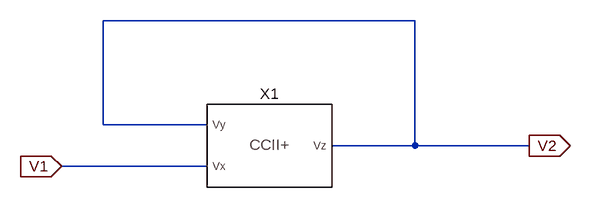
[diagram p0: schematic I-NIC.asc]
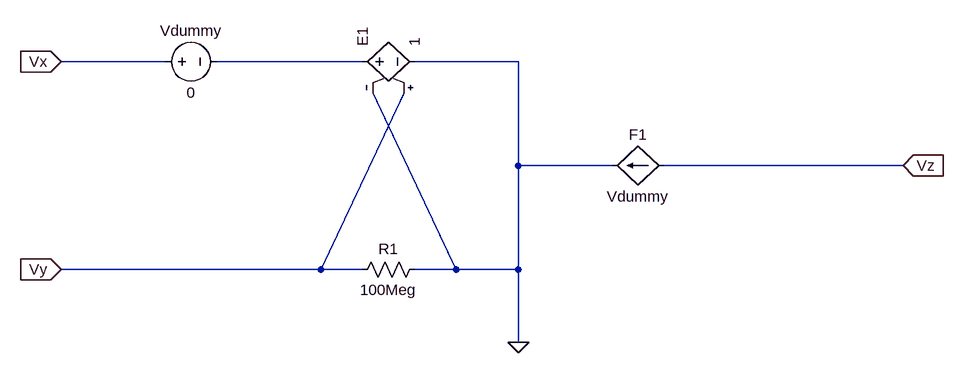
[diagram p1: sub-circuit ccii+.asc]
I-NIC.asc, the LTspice schematic file:
Version 4
SHEET 1 880 680
WIRE 464 0 -16 0
WIRE -16 160 -16 0
WIRE 144 160 -16 160
WIRE 464 192 464 0
WIRE 464 192 336 192
WIRE 640 192 464 192
WIRE 144 224 -80 224
FLAG -80 224 V1
IOPIN -80 224 In
FLAG 640 192 V2
IOPIN 640 192 Out
SYMBOL CCII+ 240 192 R0
SYMATTR InstName X1

ccii+.asc, the sub-circuit schematic file:
Version 4
SHEET 1 1476 680
WIRE -80 64 -240 64
WIRE 224 64 0 64
WIRE 464 64 304 64
WIRE 464 224 464 64
WIRE 608 224 464 224
WIRE 1056 224 688 224
WIRE 160 384 288 112
WIRE 160 384 -240 384
WIRE 224 384 160 384
WIRE 368 384 240 112
WIRE 368 384 304 384
WIRE 464 384 464 224
WIRE 464 384 368 384
WIRE 464 496 464 384
FLAG -240 64 Vx
IOPIN -240 64 In
FLAG -240 384 Vy
IOPIN -240 384 In
FLAG 1056 224 Vz
IOPIN 1056 224 In
FLAG 464 496 0
SYMBOL voltage -96 64 R270
WINDOW 0 32 56 VTop 2
WINDOW 3 -32 56 VBottom 2
SYMATTR InstName Vdummy
SYMATTR Value 0
SYMBOL f 688 224 R90
WINDOW 0 -32 40 VBottom 2
WINDOW 3 32 40 VTop 2
SYMATTR InstName F1
SYMATTR Value Vdummy
SYMATTR Value2 1
SYMBOL e2 208 64 R270
SYMATTR InstName E1
SYMATTR Value 1
SYMBOL res 320 368 R90
WINDOW 0 0 56 VBottom 2
WINDOW 3 32 56 VTop 2
SYMATTR InstName R1
SYMATTR Value 100Meg

The netlist it stands for:
* I-NIC.asc
XX1 V2 V1 V2 ccii+

* block symbol definitions
.subckt ccii+ Vy Vx Vz
Vdummy Vx N001 0
F1 Vz 0 Vdummy 1
E1 N001 0 Vy 0 1
R1 0 Vy 100Meg
.ends ccii+

.backanno
.end